# EAGLE board BigFish_Rev1 (EAGLE 7.7.0), part 1 of 2
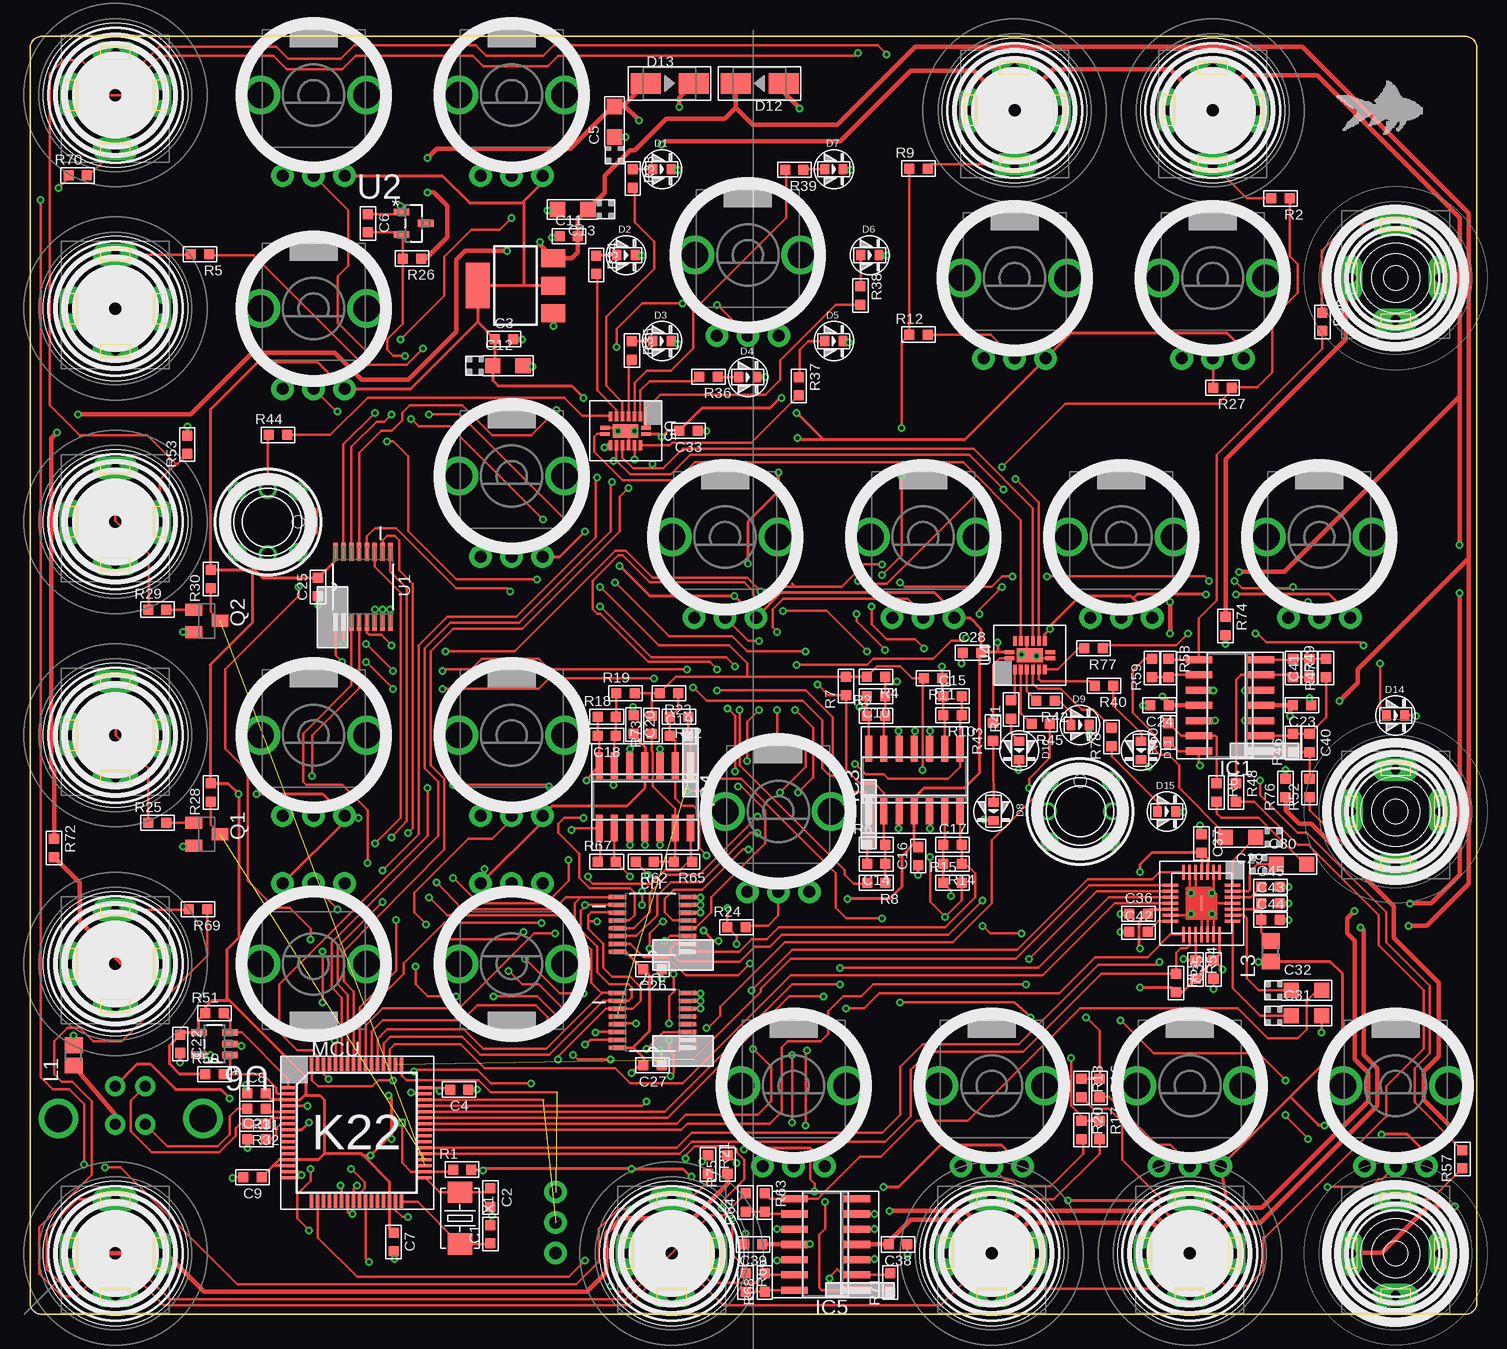
[diagram p7: board, top side]
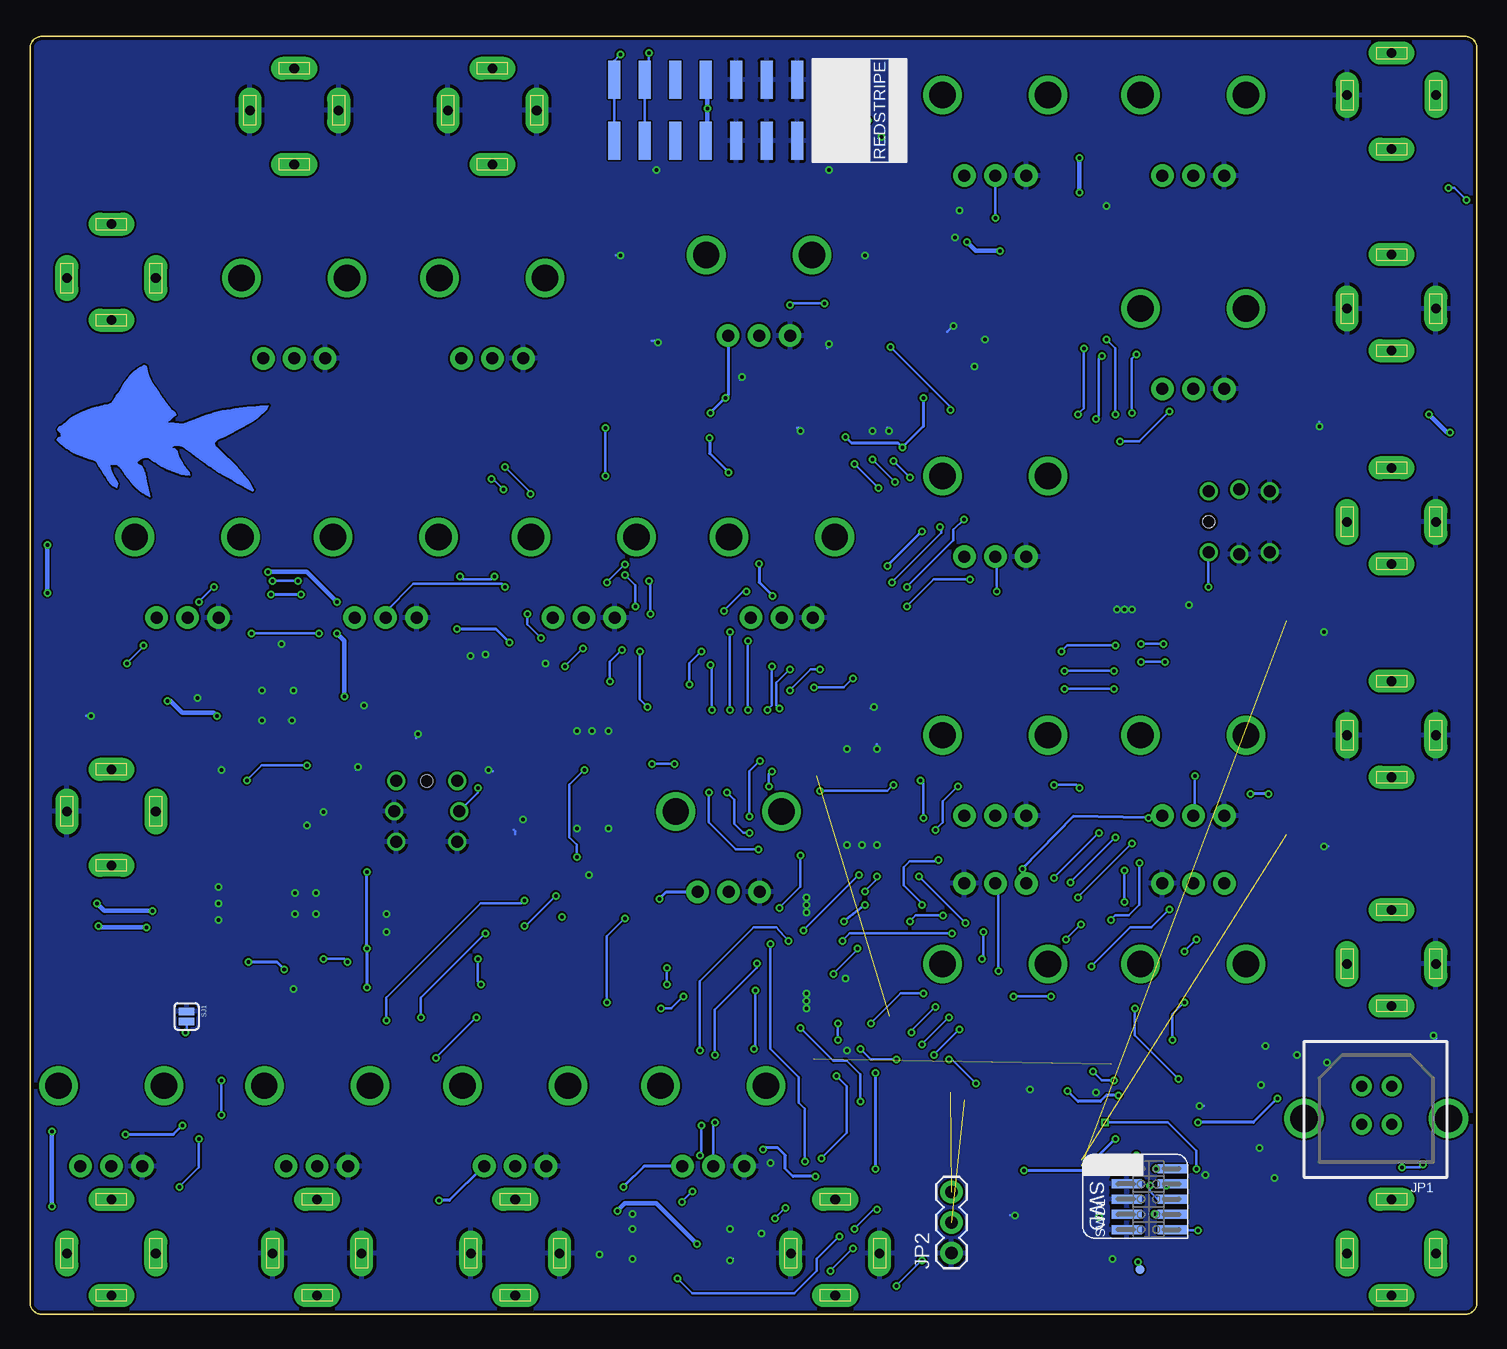
[diagram p8: board, bottom side, seen from below]

Size 120.58 x 106.5 mm. Coordinates in mm from the lower left corner, seen from the top.
Copper layers (1*16): Top 0.035mm / dielectric 1.5mm / Bottom 0.035mm
Design rules "ITEADstudio_DRC": minimum track width 6mil, minimum drill 12mil, track to track 6mil, track to pad 6mil, pad to pad 6mil, via to via 6mil, smd to smd 0mil, copper to edge 10mil, drill to drill 10mil, minimum pad ring 10mil, minimum via ring 6mil, stop-mask expansion 2mil, vias tented up to drill 100mil, thermal gap 10mil
Net classes: 0 default: width 0.203 mm; 1 heavypower: width 0.381 mm; 2 mediumpower: width 0.254 mm; 3 groundplane: width 0.254 mm, clearance 0.203 mm

## Footprints (pad centres in the part's own frame; a part is rotated, then mirrored left to right if it is on the bottom)
C0603 = smd 0.889 x 0.889: 1 -0.762,0; 2 0.762,0
AVX-A = smd 1.27 x 1.27: + -1.27,0; - 1.27,0
LED0603 = smd 0.762 x 0.889: + -0.762,0; - 0.762,0
DO-214AC = smd 2.5 x 1.7: 1 -2,0; 2 2,0
SO14 = smd 0.6 x 2.2: 1 -3.81,-2.6; 2 -2.54,-2.6; 3 -1.27,-2.6; 4 0,-2.6; 5 1.27,-2.6; 6 2.54,-2.6; 7 3.81,-2.6; 8 3.81,2.6; 9 2.54,2.6; 10 1.27,2.6; 11 0,2.6; 12 -1.27,2.6; 13 -2.54,2.6; 14 -3.81,2.6
SOT223 = smd 1.5 x 2: 1 -2.3,-3.15; 2 0,-3.15; 3 2.3,-3.15 | smd 3.8 x 2: 4 0,3.15
USB-B-PTH-VERTICAL = drill 0.914 pad 1.676: D+ 4.826,4.394; D- 4.826,7.595; GND 7.315,4.394; VBUS 7.315,7.595 | drill 2.286: P$1 0,4.902; P$2 12.04,4.902
1X03 = drill 1.016 pad 1.88: 1 0,0; 2 2.54,0; 3 5.08,0
FB603 = smd 1.3 x 1.5: 1 -0.85,0; 2 0.85,0
MK22_TQFP64 = smd 1.1 x 0.285: 1 -5.605,3.385; 2 -5.605,2.885; 3 -5.605,2.385; 4 -5.605,1.885; 5 -5.605,1.385; 6 -5.605,0.885; 7 -5.605,0.385; 8 -5.605,-0.115; 9 -5.605,-0.615; 10 -5.605,-1.115; 11 -5.605,-1.615; 12 -5.605,-2.115; 13 -5.605,-2.615; 14 -5.605,-3.115; 15 -5.605,-3.615; 16 -5.605,-4.115; 33 5.795,-4.115; 34 5.795,-3.615; 35 5.795,-3.115; 36 5.795,-2.615; 37 5.795,-2.115; 38 5.795,-1.615; 39 5.795,-1.115; 40 5.795,-0.615; 41 5.795,-0.115; 42 5.795,0.385; 43 5.795,0.885; 44 5.795,1.385; 45 5.795,1.885; 46 5.795,2.385; 47 5.795,2.885; 48 5.795,3.385 | smd 0.285 x 1.1: 17 -3.655,-6.065; 18 -3.155,-6.065; 19 -2.655,-6.065; 20 -2.155,-6.065; 21 -1.655,-6.065; 22 -1.155,-6.065; 23 -0.655,-6.065; 24 -0.155,-6.065; 25 0.345,-6.065; 26 0.845,-6.065; 27 1.345,-6.065; 28 1.845,-6.065; 29 2.345,-6.065; 30 2.845,-6.065; 31 3.345,-6.065; 32 3.845,-6.065; 49 3.845,5.335; 50 3.345,5.335; 51 2.845,5.335; 52 2.345,5.335; 53 1.845,5.335; 54 1.345,5.335; 55 0.845,5.335; 56 0.345,5.335; 57 -0.155,5.335; 58 -0.655,5.335; 59 -1.155,5.335; 60 -1.655,5.335; 61 -2.155,5.335; 62 -2.655,5.335; 63 -3.155,5.335; 64 -3.655,5.335
SOT23-BEC = smd 1 x 1.4: B -0.95,-1.1; C 0,1.1; E 0.95,-1.1
R0603 = smd 0.889 x 0.889: 1 -0.762,0; 2 0.762,0
SJ_2S = smd 0.635 x 1.27: 1 -0.412,0; 2 0.412,0
M50-3600542 = smd 0.75 x 2.5: 1 -2.54,-1.81; 2 -2.54,2; 3 -1.27,-1.81; 4 -1.27,2; 5 0,-1.81; 6 0,2; 7 1.27,-1.81; 8 1.27,2; 9 2.54,-1.81; 10 2.54,2
PAD.03X.03 = smd 0.762 x 0.762: P$1 0,0
SOP65P640X120-16N = smd 1.473 x 0.356: 1 -2.921,2.286; 2 -2.921,1.626; 3 -2.921,0.965; 4 -2.921,0.33; 5 -2.921,-0.33; 6 -2.921,-0.965; 7 -2.921,-1.626; 8 -2.921,-2.286; 9 2.921,-2.286; 10 2.921,-1.626; 11 2.921,-0.965; 12 2.921,-0.33; 13 2.921,0.33; 14 2.921,0.965; 15 2.921,1.626; 16 2.921,2.286
SOT95P237X112-3N = smd 1.321 x 0.559: 1 -1.016,0.94; 2 -1.016,-0.94; 3 1.016,0
QFN50P250X350X100-17N = smd 0.305 x 0.813: 1 -0.254,1.702; 8 -0.254,-1.702; 9 0.254,-1.702; 16 0.254,1.702 | smd 0.813 x 0.305: 2 -1.194,1.245; 3 -1.194,0.762; 4 -1.194,0.254; 5 -1.194,-0.254; 6 -1.194,-0.762; 7 -1.194,-1.245; 10 1.194,-1.245; 11 1.194,-0.762; 12 1.194,-0.254; 13 1.194,0.254; 14 1.194,0.762; 15 1.194,1.245 | smd 1.143 x 2.159: 17 0,0
SOT95P290X145-5N = smd 1.27 x 0.559: 1 -1.295,0.94; 2 -1.295,0; 3 -1.295,-0.94; 4 1.295,-0.94; 5 1.295,0.94
OG-POTS_ALPS_POT_VERTICAL = drill 1 pad 1.88: P$1 -2.58,-6.7; P$2 0,-6.7; P$3 2.58,-6.7 | drill 2.2 pad 3.175: P$4 4.4,0; P$5 -4.4,0
3.5MM-JACK-SWITCH-13MM-INPUT = drill 0.8 pad 1.93 long: RING@3 -3.7,0; SECOND@3 0,-3.5; SWITCH@3 3.7,0; TIP@3 0,4.5
3.5MM-JACK-SWITCH-13MM-OUTPUT = drill 0.8 pad 1.93 long: RING@3 -3.7,0; SECOND@3 0,-3.5; SWITCH@3 3.7,0; TIP@3 0,4.5
2X08_SMT_HEADER = smd 1 x 3.17: 1 -8.89,-2.54; 2 -8.89,2.54; 3 -6.35,-2.54; 4 -6.35,2.54; 5 -3.81,-2.54; 6 -3.81,2.54; 7 -1.27,-2.54; 8 -1.27,2.54; 9 1.27,-2.54; 10 1.27,2.54; 11 3.81,-2.54; 12 3.81,2.54; 13 6.35,-2.54; 14 6.35,2.54; 15 8.89,-2.54; 16 8.89,2.54
PB6149L = drill 1: 1 2.54,2.54; 2 2.54,-2.54; 3 -2.54,2.54; 4 -2.54,-2.54; LEDNEG 0,-2.7; LEDPOS 0,2.7 | hole 1: 2.54,0
QFN28 = smd 1.27 x 0.23: P$1 -2.585,1.5; P$2 -2.585,1; P$3 -2.585,0.5; P$4 -2.585,0; P$5 -2.585,-0.5; P$6 -2.585,-1; P$7 -2.585,-1.5; P$15 2.585,-1.5; P$16 2.585,-1; P$17 2.585,-0.5; P$18 2.585,0; P$19 2.585,0.5; P$20 2.585,1; P$21 2.585,1.5; PAD 0,0 | smd 0.23 x 1.27: P$8 -1.5,-2.585; P$9 -1,-2.585; P$10 -0.5,-2.585; P$11 0,-2.585; P$12 0.5,-2.585; P$13 1,-2.585; P$14 1.5,-2.585; P$22 1.5,2.585; P$23 1,2.585; P$24 0.5,2.585; P$25 0,2.585; P$26 -0.5,2.585; P$27 -1,2.585; P$28 -1.5,2.585
2P-SMD-5.0X3.2 = smd 1.778 x 2.032: 1 -2.159,0; 2 2.159,0

## Placement (x,y rotation side)
C1  22pF  [C0603]  38.37,6.68 90 top
C2  22pF  [C0603]  38.37,9.73 270 top
C3  100nF  [C0603]  39.51,81.28 0 top
C4  100nF  [C0603]  35.76,18.73 180 top
C5  10uF  [AVX-A]  48.71,99.38 90 top
C6  100nF  [C0603]  28.16,90.92 270 top
C7  100nF  [C0603]  30.3,6.03 270 top
C8  100nF  [C0603]  18.87,18.41 0 top
C9  100nF  [C0603]  18.55,11.43 180 top
C10  3.3nF  [C0603]  70.5,51.5 180 top
C11  100nF  [C0603]  44.9,89.85 0 top
C12  10uF  [AVX-A]  39.82,79.06 0 top
C13  10uF  [AVX-A]  45.22,92.08 180 top
C14  3.3nF  [C0603]  70.52,37.55 180 top
C15  3.3nF  [C0603]  76.87,51.52 0 top
C16  100nF  [C0603]  74.01,38.19 90 top
C17  3.3nF  [C0603]  76.87,39.14 0 top
C18  3.3nF  [C0603]  48.06,48.2 180 top
C19  3.3nF  [C0603]  54.09,48.2 0 top
C20  100nF  [C0603]  50.3,49.16 270 top
C21  1uF  [C0603]  18.87,14.61 0 top
C22  100nF  [C0603]  12.52,22.54 270 top
C23  100nF  [C0603]  106,50.75 180 top
C24  100nF  [C0603]  94.12,50.75 180 top
C25  100nF  [C0603]  24,60.62 90 top
C26  100nF  [C0603]  51.88,28.75 180 top
C27  100nF  [C0603]  51.88,20.75 180 top
C28  100nF  [C0603]  78.5,55.12 0 top
C29  10uF  [AVX-A]  100.88,39.75 180 top
C30  10uF  [AVX-A]  105.12,37.5 0 top
C31  10uF  [AVX-A]  106.38,24.88 0 top
C32  10uF  [AVX-A]  106.38,27 0 top
C33  100nF  [C0603]  54.88,73.62 180 top
C35  1uF  [C0603]  98.62,28.75 90 top
C36  100nF  [C0603]  92.38,33.38 0 top
C37  100nF  [C0603]  97.62,39.25 270 top
C38  100nF  [C0603]  72.33,5.83 180 top
C39  100nF  [C0603]  60.27,5.83 180 top
C40  3.3nF  [C0603]  106.62,47.62 270 top
C41  3.3nF  [C0603]  106.62,53.88 90 top
C42  1uF  [C0603]  92.38,31.88 0 top
C43  1uF  [C0603]  103.38,34.25 0 top
C44  100nF  [C0603]  103.38,32.88 0 top
C45  1uF  [C0603]  103.38,35.62 0 top
D1  YELLOW  [LED0603]  52.66,95.43 0 top
D2  YELLOW  [LED0603]  49.66,88.27 0 top
D3  YELLOW  [LED0603]  52.66,81.1 0 top
D4  YELLOW  [LED0603]  59.83,78.11 0 top
D5  YELLOW  [LED0603]  66.99,81.1 0 top
D6  YELLOW  [LED0603]  69.98,88.27 0 top
D7  YELLOW  [LED0603]  66.99,95.43 0 top
D8  YELLOW  [LED0603]  80.3,41.91 270 top
D9  YELLOW  [LED0603]  87.51,49.12 0 top
D10  YELLOW  [LED0603]  82.43,46.99 270 top
D11  YELLOW  [LED0603]  92.59,46.99 270 top
D12  MRA4004T3G  [DO-214AC]  60.8,102.57 180 top
D13  MRA4004T3G  [DO-214AC]  53.29,102.57 0 top
D14  YELLOW  [LED0603]  113.8,49.91 0 top
D15  YELLOW  [LED0603]  94.72,41.91 0 top
IC1  TL074D  [SO14]  100,50.75 90 top
IC2  LD1117S33CTR  [SOT223]  40.46,85.72 90 top
IC3  MCP6004  [SO14]  73.69,44.53 0 top
IC4  MCP6004  [SO14]  51.24,43.12 180 top
IC5  TL074D  [SO14]  66.3,5.83 90 top
JP1  USBPTH-VERTICAL  [USB-B-PTH-VERTICAL]  14.42,11.43 0 bottom
JP2  3pin header  [1X03]  43.79,5.11 90 bottom
L1  600  [FB603]  3.63,21.58 90 top
L3  600  [FB603]  103.38,30.25 90 top
MCU  MK22_120_TQFP64  [MK22_TQFP64]  27.12,15.5 0 top
Q1  MMBT3904  [SOT23-BEC]  14.74,40.01 270 top
Q2  MMBT3904  [SOT23-BEC]  14.74,57.78 270 top
R1  10k  [R0603]  36.01,12.06 0 top
R2  100k  [R0603]  104.2,93 180 top
R3  33k  [R0603]  70.5,49.88 0 top
R4  51k  [R0603]  70.5,53.12 180 top
R5  100k  [R0603]  14.17,88.33 180 top
R6  33k  [R0603]  70.52,39.14 0 top
R7  51k  [R0603]  68,52.38 90 top
R8  33k  [R0603]  70.52,35.96 180 top
R9  100k  [R0603]  74.05,95.48 0 top
R10  33k  [R0603]  76.87,49.93 180 top
R11  51k  [R0603]  75.25,53 180 top
R12  33k  [R0603]  74.04,81.66 0 top
R13  100k  [R0603]  87.62,18.88 270 top
R14  33k  [R0603]  76.87,37.55 180 top
R15  51k  [R0603]  76.87,35.96 0 top
R16  33k  [R0603]  89.12,18.88 270 top
R17  100k  [R0603]  89.12,15.38 270 top
R18  33k  [R0603]  48.06,49.79 0 top
R19  51k  [R0603]  49.62,51.75 0 top
R20  33k  [R0603]  87.62,15.38 270 top
R21  100k  [R0603]  56.5,12.5 270 top
R22  33k  [R0603]  54.09,49.79 180 top
R23  51k  [R0603]  53.25,51.75 180 top
R24  33k  [R0603]  58.88,32.25 0 top
R25  100k  [R0603]  10.61,40.96 0 top
R26  10k  [R0603]  31.83,87.98 180 top
R27  33k  [R0603]  99.38,77.22 180 top
R28  10k  [R0603]  15.06,43.5 90 top
R29  100k  [R0603]  10.61,58.74 0 top
R30  10k  [R0603]  15.06,61.28 90 top
R31  33  [R0603]  18.87,17.14 180 top
R32  33  [R0603]  18.87,15.88 180 top
R33  56  [R0603]  50.23,94.66 270 top
R34  56  [R0603]  47.19,87.47 270 top
R35  56  [R0603]  50.16,80.33 270 top
R36  56  [R0603]  56.55,78.13 180 top
R37  56  [R0603]  64.07,77.35 270 top
R38  56  [R0603]  69.21,84.9 270 top
R39  56  [R0603]  63.69,95.38 180 top
R40  56  [R0603]  89.5,52.38 180 top
R41  56  [R0603]  81.75,50.41 90 top
R42  56  [R0603]  84.62,51.12 180 top
R43  56  [R0603]  80.25,48.55 90 top
R44  56  [R0603]  20.68,73.28 0 top
R45  56  [R0603]  84.23,49.2 180 top
R46  100k  [R0603]  105.25,47.62 90 top
R47  100k  [R0603]  108,53.88 90 top
R48  100k  [R0603]  100.5,43.5 270 top
R49  100k  [R0603]  105.25,53.88 270 top
R50  2k  [R0603]  15.38,20 0 top
R51  2k  [R0603]  15.38,25.08 0 top
R52  100  [R0603]  106.62,43.88 90 top
R53  1m  [R0603]  13.1,72.47 90 top
R54  2k  [R0603]  97.12,28.75 270 top
R55  2k  [R0603]  95.5,27.62 270 top
R56  56  [R0603]  107.7,82.72 270 top
R57  56  [R0603]  119.37,12.93 90 top
R58  100k  [R0603]  94.88,53.88 270 top
R59  24k  [R0603]  93.5,53.88 90 top
R60  100k  [R0603]  94.88,48.5 90 top
R61  24k  [R0603]  98.88,43.5 270 top
R62  10k  [R0603]  51.24,37.73 180 top
R63  24k  [R0603]  61.22,9.32 270 top
R64  100k  [R0603]  59.63,9.32 90 top
R65  10k  [R0603]  54.41,37.73 180 top
R66  100k  [R0603]  59.63,2.65 270 top
R67  100k  [R0603]  48.06,37.73 0 top
R68  24k  [R0603]  61.22,2.65 90 top
R69  24k  [R0603]  14,33.75 180 top
R70  180k  [R0603]  3.97,94.92 0 top
R71  100k  [R0603]  71.7,2.65 90 top
R72  100k  [R0603]  2,38.88 270 top
R73  100k  [R0603]  51.8,49.13 90 top
R74  0  [R0603]  99.62,57.38 270 top
R75  0  [R0603]  58.12,12.5 90 top
R76  0  [R0603]  104.62,43.88 90 top
R77  56  [R0603]  88.62,55.5 180 top
R78  56  [R0603]  90.12,48.12 90 top
SJ1  SOLDERJUMPERNC  [SJ_2S]  107.53,24.83 270 bottom
SWD1  CORTEX_SWD  [M50-3600542]  27.36,9.6 270 bottom
TP1  TEST-POINT3  [PAD.03X.03]  28.07,3.73 0 bottom
U1  CD4051BPW  [SOP65P640X120-16N]  27.75,60.62 90 top
U2  LM4040DIM3-5.0  [SOT95P237X112-3N]  31.97,90.92 0 top
U3  CD4051BPW  [SOP65P640X120-16N]  51.88,32.5 180 top
U4  74HC595BQ  [QFN50P250X350X100-17N]  83.32,54.93 90 top
U5  74HC595BQ  [QFN50P250X350X100-17N]  49.62,73.62 270 top
U6  24LC16T-I/OT  [SOT95P290X145-5N]  15.38,22.54 180 top
U7  CD4051BPW  [SOP65P640X120-16N]  51.88,24.5 180 top
U$1  EURORACK_PCB24HP  [EURORACK24HPPCB]  -0.5,0 0 top
U$2  10kB  [OG-POTS_ALPS_POT_VERTICAL]  23.63,101.6 0 top
U$3  10kB  [OG-POTS_ALPS_POT_VERTICAL]  23.63,83.82 0 top
U$4  10kB  [OG-POTS_ALPS_POT_VERTICAL]  40.14,101.6 0 top
U$5  10kB  [OG-POTS_ALPS_POT_VERTICAL]  62.37,41.91 0 top
U$6  10kB  [OG-POTS_ALPS_POT_VERTICAL]  96.66,19.05 0 top
U$7  10kB  [OG-POTS_ALPS_POT_VERTICAL]  63.64,19.05 0 top
U$8  10kB  [OG-POTS_ALPS_POT_VERTICAL]  113.8,19.05 0 top
U$9  10kB  [OG-POTS_ALPS_POT_VERTICAL]  80.14,19.05 0 top
U$10  10kB  [OG-POTS_ALPS_POT_VERTICAL]  40.14,69.85 0 top
U$11  10kB  [OG-POTS_ALPS_POT_VERTICAL]  40.14,48.26 0 top
U$12  10kB  [OG-POTS_ALPS_POT_VERTICAL]  59.83,88.27 0 top
U$13  10kB  [OG-POTS_ALPS_POT_VERTICAL]  82.05,86.36 0 top
U$14  10kB  [OG-POTS_ALPS_POT_VERTICAL]  98.56,86.36 0 top
U$15  10kB  [OG-POTS_ALPS_POT_VERTICAL]  57.92,64.77 0 top
U$16  10kB  [OG-POTS_ALPS_POT_VERTICAL]  74.43,64.77 0 top
U$17  10kB  [OG-POTS_ALPS_POT_VERTICAL]  90.94,64.77 0 top
U$18  10kB  [OG-POTS_ALPS_POT_VERTICAL]  107.45,64.77 0 top
U$19  10kB  [OG-POTS_ALPS_POT_VERTICAL]  23.63,29.21 180 top
U$20  10kB  [OG-POTS_ALPS_POT_VERTICAL]  40.14,29.21 180 top
U$21  10kB  [OG-POTS_ALPS_POT_VERTICAL]  23.63,48.26 0 top
U$22  PJ-341  [3.5MM-JACK-SWITCH-13MM-INPUT]  7.12,101.6 180 top
U$23  PJ-341  [3.5MM-JACK-SWITCH-13MM-INPUT]  7.12,83.82 0 top
U$24  PJ-341  [3.5MM-JACK-SWITCH-13MM-INPUT]  53.48,5.08 0 top
U$25  PJ-341  [3.5MM-JACK-SWITCH-13MM-INPUT]  96.66,5.08 0 top
U$26  PJ-341  [3.5MM-JACK-SWITCH-13MM-INPUT]  80.14,5.08 0 top
U$27  PJ-341  [3.5MM-JACK-SWITCH-13MM-INPUT]  7.12,5.08 0 top
U$28  PJ-341  [3.5MM-JACK-SWITCH-13MM-INPUT]  7.12,48.26 0 top
U$29  PJ-341  [3.5MM-JACK-SWITCH-13MM-INPUT]  82.05,100.33 180 top
U$30  PJ-341  [3.5MM-JACK-SWITCH-13MM-INPUT]  98.56,100.33 180 top
U$31  PJ-341  [3.5MM-JACK-SWITCH-13MM-INPUT]  7.12,29.21 0 top
U$32  PJ-341  [3.5MM-JACK-SWITCH-13MM-INPUT]  7.12,66.04 0 top
U$34  PJ-341  [3.5MM-JACK-SWITCH-13MM-OUTPUT]  113.8,41.91 180 top
U$35  POWERSMT  [2X08_SMT_HEADER]  63,100.33 180 bottom
U$36  PJ-341  [3.5MM-JACK-SWITCH-13MM-OUTPUT]  113.8,5.08 0 top
U$37  PJ-341  [3.5MM-JACK-SWITCH-13MM-OUTPUT]  113.8,86.36 0 top
U$38  SWITCH_W_LED_PB6149L-X-102YELLOW  [PB6149L]  19.82,66.04 0 top
U$39  SWITCH_W_LED_PB6149L-X-102YELLOW  [PB6149L]  87.51,41.91 90 top
U$45  FISH2CM  [FISH]  111,72.88 0 bottom
U$48  AK4558  [QFN28]  97.62,34.25 270 top
U$49  FISH_SMALL  [FISH_SMALL]  114.25,100.38 0 top
X1  CRYSTAL-0500290P1  [2P-SMD-5.0X3.2]  35.83,8.02 270 top